# Altium schematic sheet USB.SCHDOC
size B
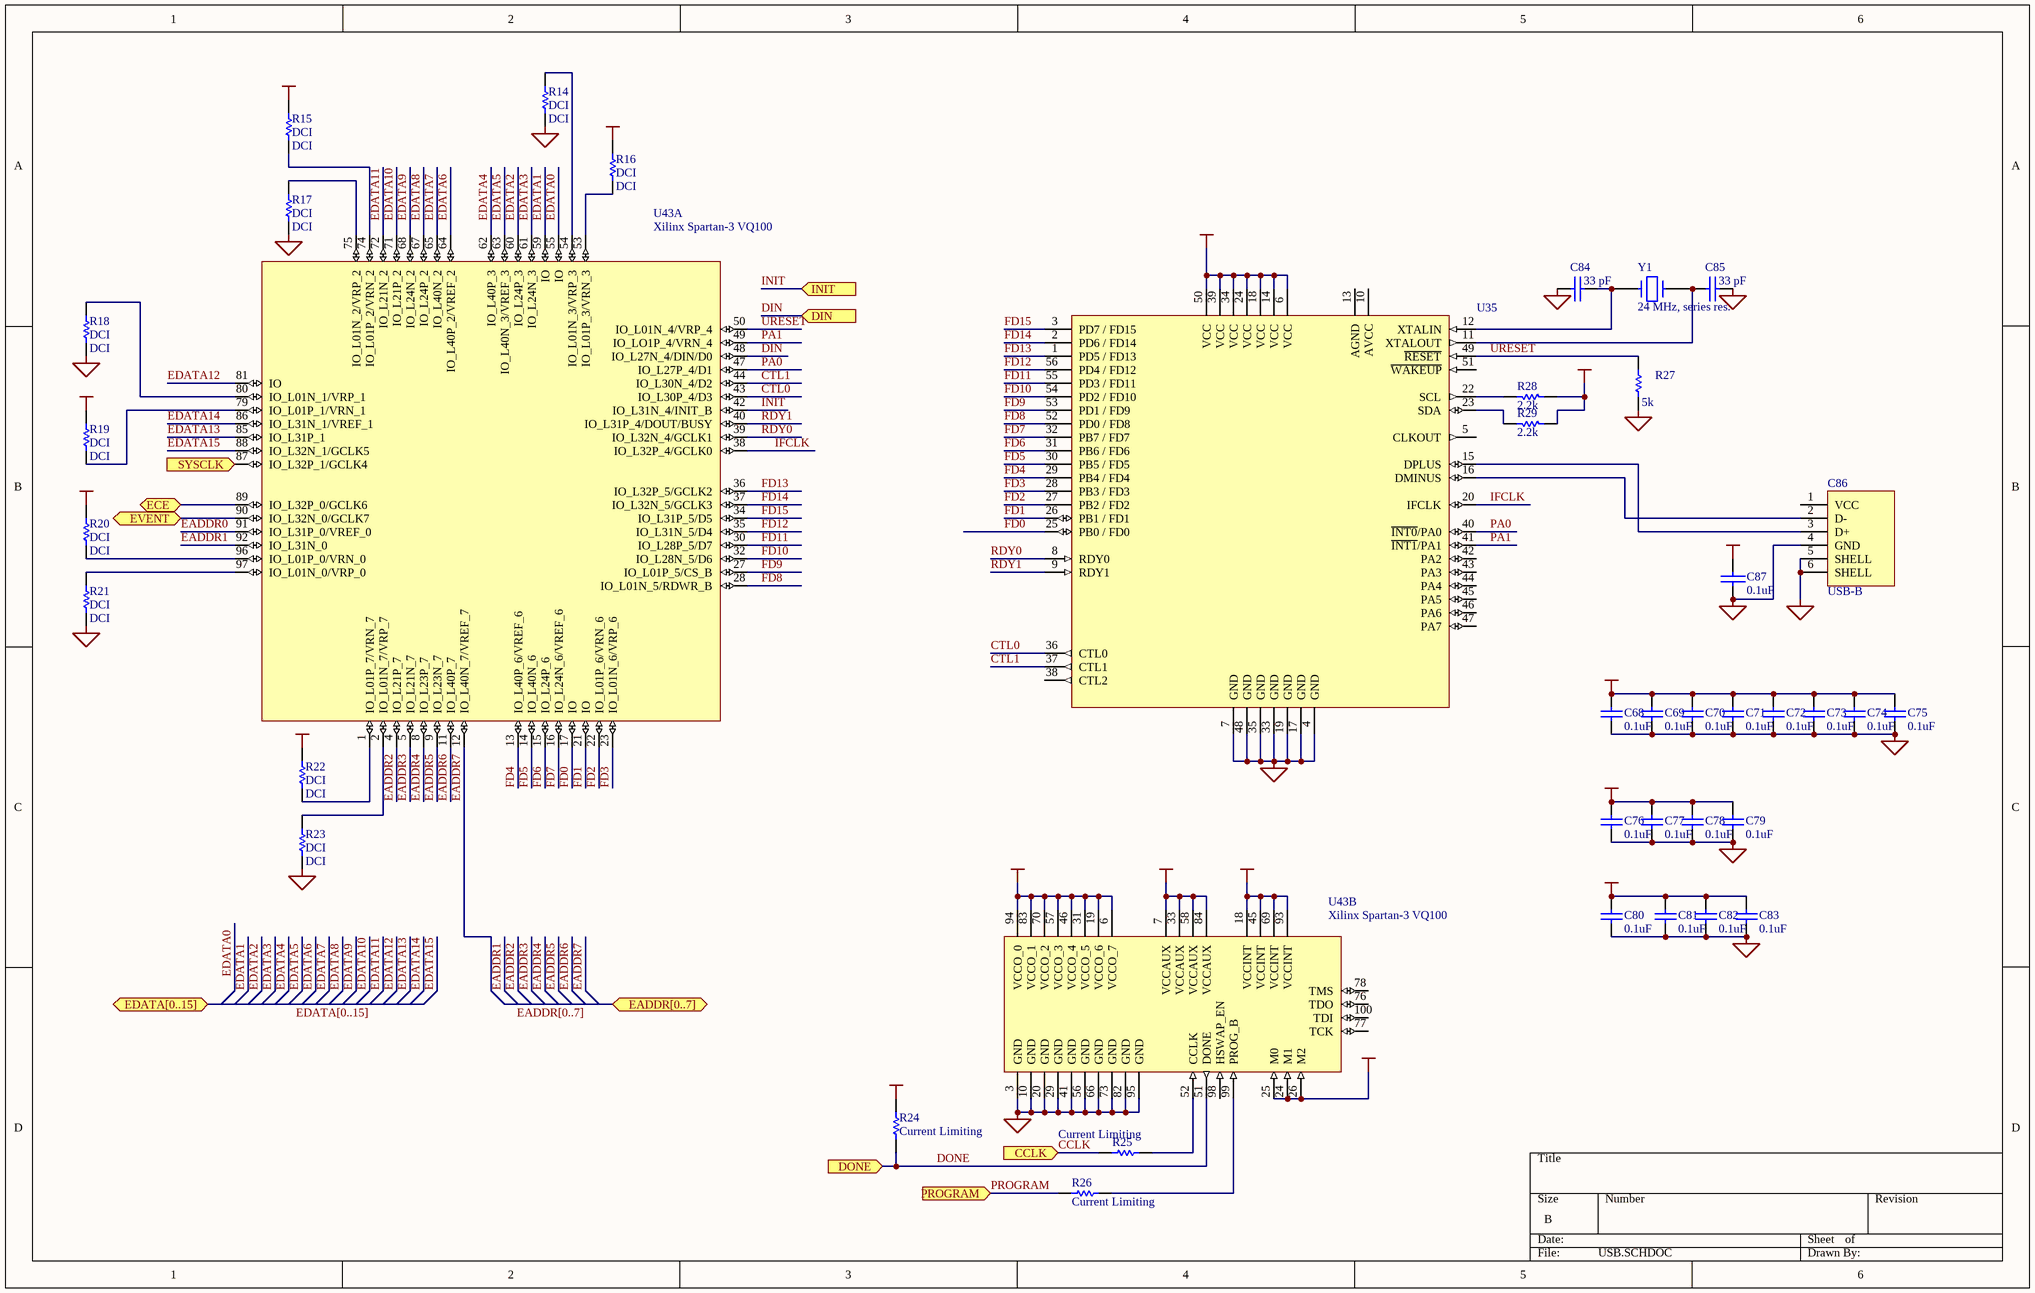
[diagram p0: USB.SCHDOC]

## Parts
C68  value 0.1uF  [CC1608-0603]  (hidden comment: Cap)
C69  value 0.1uF  [CC1608-0603]  (hidden comment: Cap)
C70  value 0.1uF  [CC1608-0603]  (hidden comment: Cap)
C71  value 0.1uF  [CC1608-0603]  (hidden comment: Cap)
C72  value 0.1uF  [CC1608-0603]  (hidden comment: Cap)
C73  value 0.1uF  [CC1608-0603]  (hidden comment: Cap)
C74  value 0.1uF  [CC1608-0603]  (hidden comment: Cap)
C75  value 0.1uF  [CC1608-0603]  (hidden comment: Cap)
C76  value 0.1uF  [CC1608-0603]  (hidden comment: Cap)
C77  value 0.1uF  [CC1608-0603]  (hidden comment: Cap)
C78  value 0.1uF  [CC1608-0603]  (hidden comment: Cap)
C79  value 0.1uF  [CC1608-0603]  (hidden comment: Cap)
C80  value 0.1uF  [CC1608-0603]  (hidden comment: Cap)
C81  value 0.1uF  [CC1608-0603]  (hidden comment: Cap)
C82  value 0.1uF  [CC1608-0603]  (hidden comment: Cap)
C83  value 0.1uF  [CC1608-0603]  (hidden comment: Cap)
C84  33 pF  [CC1608-0603]
C85  33 pF  [CC1608-0603]
C86  USB-B  [USB-B]
C87  0.1uF  [CC1608-0603]
R14  DCI  [CC1608-0603]
R15  DCI  [CC1608-0603]
R16  DCI  [CC1608-0603]
R17  DCI  [CC1608-0603]
R18  DCI  [CC1608-0603]
R19  DCI  [CC1608-0603]
R20  DCI  [CC1608-0603]
R21  DCI  [CC1608-0603]
R22  DCI  [CC1608-0603]
R23  DCI  [CC1608-0603]
R24  Current Limiting  [CC1608-0603]
R25  Current Limiting  [CC1608-0603]
R26  Current Limiting  [CC1608-0603]
R27  value 5k  [CC3216-1206]  (hidden comment: Res1)
R28  value 2.2k  [CC3216-1206]  (hidden comment: Res1)
R29  value 2.2k  [CC3216-1206]  (hidden comment: Res1)
U35  (no value)  [SOP56FX2]
U43  Xilinx Spartan-3 VQ100  [F-QFP14X14-G100/N]  (parts A,B of 2)
Y1  24 MHz, series res.  [ECX-3S]

## Ports
CCLK (in), DIN (in), DONE (in), EADDR[0..7] (bidir), ECE (bidir), EDATA[0..15] (bidir), EVENT (bidir), INIT (in), PROGRAM (in), SYSCLK (in)

## Nets
+1.2VCCUSB: C76.1 C77.1 C78.1 C79.1 U43.18(VCCINT) U43.45(VCCINT) U43.69(VCCINT) U43.93(VCCINT)
+2.5VCC: C80.1 C81.1 C82.1 C83.1 U43.7(VCCAUX) U43.33(VCCAUX) U43.58(VCCAUX) U43.84(VCCAUX)
GND: C68.2 C69.2 C70.2 C71.2 C72.2 C73.2 C74.2 C75.2 C76.2 C77.2 C78.2 C79.2 C80.2 C81.2 C82.2 C83.2 C84.2 C85.1 C86.4(GND) C86.5(SHELL) C86.6(SHELL) C87.2 R14.1 R17.1 R18.1 R21.1 R23.1 R27.1 U35.4(GND) U35.7(GND) U35.17(GND) U35.19(GND) U35.33(GND) U35.35(GND) U35.48(GND) U43.3(GND) U43.10(GND) U43.20(GND) U43.29(GND) U43.41(GND) U43.56(GND) U43.66(GND) U43.73(GND) U43.82(GND) U43.95(GND)
VCC: C68.1 C69.1 C70.1 C71.1 C72.1 C73.1 C74.1 C75.1 C87.1 R15.2 R16.2 R19.2 R20.2 R22.2 R24.2 R28.1 R29.1 U35.6(VCC) U35.14(VCC) U35.18(VCC) U35.24(VCC) U35.34(VCC) U35.39(VCC) U35.50(VCC) U43.6(VCCO_7) U43.19(VCCO_6) U43.24(M1) U43.25(M0) U43.26(M2) U43.31(VCCO_5) U43.46(VCCO_4) U43.57(VCCO_3) U43.70(VCCO_2) U43.83(VCCO_1) U43.94(VCCO_0)
CCLK: R25.1 ; port CCLK
CTL0: U35.36(CTL0) U43.43(IO_L30P_4/D3)
CTL1: U35.37(CTL1) U43.44(IO_L30N_4/D2)
DIN: U43.48(IO_L27N_4/DIN/D0) ; port DIN
DONE: R24.1 U43.51(DONE) ; port DONE
EADDR0: U43.91(IO_L31P_0/VREF_0)
EADDR1: U43.92(IO_L31N_0)
EADDR2: U43.4(IO_L21P_7)
EADDR3: U43.5(IO_L21N_7)
EADDR4: U43.8(IO_L23P_7)
EADDR5: U43.9(IO_L23N_7)
EADDR6: U43.11(IO_L40P_7)
EADDR7: U43.12(IO_L40N_7/VREF_7)
ECE: U43.89(IO_L32P_0/GCLK6) ; port ECE
EDATA0: U43.55(IO)
EDATA1: U43.59(IO)
EDATA2: U43.60(IO_L24P_3)
EDATA3: U43.61(IO_L24N_3)
EDATA4: U43.62(IO_L40P_3)
EDATA5: U43.63(IO_L40N_3/VREF_3)
EDATA6: U43.64(IO_L40P_2/VREF_2)
EDATA7: U43.65(IO_L40N_2)
EDATA8: U43.67(IO_L24P_2)
EDATA9: U43.68(IO_L24N_2)
EDATA10: U43.71(IO_L21P_2)
EDATA11: U43.72(IO_L21N_2)
EDATA12: U43.81(IO)
EDATA13: U43.85(IO_L31P_1)
EDATA14: U43.86(IO_L31N_1/VREF_1)
EDATA15: U43.88(IO_L32N_1/GCLK5)
EVENT: U43.90(IO_L32N_0/GCLK7) ; port EVENT
FD0: U35.25(PB0_/_FD0) U43.17(IO)
FD1: U35.26(PB1_/_FD1) U43.21(IO)
FD2: U35.27(PB2_/_FD2) U43.22(IO_L01P_6/VRN_6)
FD3: U35.28(PB3_/_FD3) U43.23(IO_L01N_6/VRP_6)
FD4: U35.29(PB4_/_FD4) U43.13(IO_L40P_6/VREF_6)
FD5: U35.30(PB5_/_FD5) U43.14(IO_L40N_6)
FD6: U35.31(PB6_/_FD6) U43.15(IO_L24P_6)
FD7: U35.32(PB7_/_FD7) U43.16(IO_L24N_6/VREF_6)
FD8: U35.52(PD0_/_FD8) U43.28(IO_L01N_5/RDWR_B)
FD9: U35.53(PD1_/_FD9) U43.27(IO_L01P_5/CS_B)
FD10: U35.54(PD2_/_FD10) U43.32(IO_L28N_5/D6)
FD11: U35.55(PD3_/_FD11) U43.30(IO_L28P_5/D7)
FD12: U35.56(PD4_/_FD12) U43.35(IO_L31N_5/D4)
FD13: U35.1(PD5_/_FD13) U43.36(IO_L32P_5/GCLK2)
FD14: U35.2(PD6_/_FD14) U43.37(IO_L32N_5/GCLK3)
FD15: U35.3(PD7_/_FD15) U43.34(IO_L31P_5/D5)
IFCLK: U35.20(IFCLK) U43.38(IO_L32P_4/GCLK0)
INIT: U43.42(IO_L31N_4/INIT_B) ; port INIT
PA0: U35.40(~{INT0}/PA0) U43.47(IO_L27P_4/D1)
PA1: U35.41(~{INT1}/PA1) U43.49(IO_LO1P_4/VRN_4)
PROGRAM: R26.1 ; port PROGRAM
RDY0: U35.8(RDY0) U43.39(IO_L32N_4/GCLK1)
RDY1: U35.9(RDY1) U43.40(IO_L31P_4/DOUT/BUSY)
SYSCLK: U43.87(IO_L32P_1/GCLK4) ; port SYSCLK
URESET: R27.2 U35.49(~{RESET}) U43.50(IO_L01N_4/VRP_4)
NetC84_1: C84.1 U35.12(XTALIN) Y1.1
NetC85_2: C85.2 U35.11(XTALOUT) Y1.2
NetC86_2: C86.2(D-) U35.16(DMINUS)
NetC86_3: C86.3(D+) U35.15(DPLUS)
NetR14_2: R14.2 U43.54(IO_L01N_3/VRP_3)
NetR15_1: R15.1 U43.74(IO_L01P_2/VRN_2)
NetR16_1: R16.1 U43.53(IO_L01P_3/VRN_3)
NetR17_2: R17.2 U43.75(IO_L01N_2/VRP_2)
NetR18_2: R18.2 U43.80(IO_L01N_1/VRP_1)
NetR19_1: R19.1 U43.79(IO_L01P_1/VRN_1)
NetR20_1: R20.1 U43.96(IO_L01P_0/VRN_0)
NetR21_2: R21.2 U43.97(IO_L01N_0/VRP_0)
NetR22_1: R22.1 U43.1(IO_L01P_7/VRN_7)
NetR23_2: R23.2 U43.2(IO_L01N_7/VRP_7)
NetR25_2: R25.2 U43.52(CCLK)
NetR26_2: R26.2 U43.99(PROG_B)
NetR28_2: R28.2 U35.22(SCL)
NetR29_2: R29.2 U35.23(SDA)

Not connected (* = marked no-connect by the designer): C86 1(VCC); U35 5(CLKOUT) 10(AVCC) 13(AGND) 38(CTL2) 42(PA2) 43(PA3) 44(PA4) 45(PA5) 46(PA6) 47(PA7) 51(~{WAKEUP}); U43 76(TDO) 77(TCK) 78(TMS) 98(HSWAP_EN) 100(TDI)

## Buses and harness runs
bus EADDR[0..7] = port EADDR[0..7]
bus EDATA[0..15] = port EDATA[0..15]

## Library data of the parts
C68-C83 = Cap: Capacitor; Manufacturer: Generic Components; Class I: Passive; Published: 8-Jun-2000; Revision: July-2002: Re-released for DXP Platform.; Publisher: Altium Limited; Class II: Capacitor
C84 C85 C87 = CAP: Capacitor
R14-R23 R27-R29 = Res1: Resistor; Manufacturer: Generic Components; Class I: Passive; Published: 8-Jun-2000; Revision: July-2002: Re-released for DXP Platform.; Publisher: Altium Limited; Class II: Resistor
  R14-R23: Value: DCI
R24-R26 = Res1: Resistor; Manufacturer: Generic Components; Class I: Passive; Value: 1K; Published: 8-Jun-2000; Revision: July-2002: Re-released for DXP Platform.; Publisher: Altium Limited; Class II: Resistor
U35 = CY7C68013-56: Cypress EZ-USB FX2
U43 = XC3S50-VQ100
Y1 = CRYSTAL